# EAGLE design 74LV2G07DBVR (EAGLE 9.2.0)
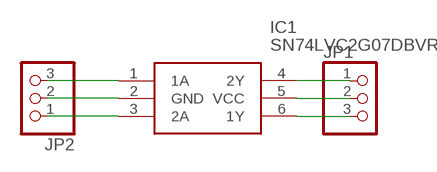
[diagram p0: schematic, sheet 1]

## Parts
IC1  SN74LVC2G07DBVR  [SOT95P280X145-6N]
JP1  PINHD-1X3  [1X03]
JP2  PINHD-1X3  [1X03]

## Nets
N$1: IC1.2(GND) JP2.2
N$2: IC1.1(1A) JP2.3
N$3: IC1.3(2A) JP2.1
N$4: IC1.6(1Y) JP1.3
N$5: IC1.4(2Y) JP1.1
N$6: IC1.5(VCC) JP1.2

## Library data of the parts
IC1 = SN74LVC2G07DBVR:SN74LVC2G07DBVR: DUAL BUFFER/DRIVER WITH OPEN-DRAIN OUTPUTS Source: Datasheet <http://componentsearchengine.com/Datasheets/3/SN74LVC2G07DBVR.pdf>; ARROW_PART_NUMBER: SN74LVC2G07DBVR; ARROW_PRICE/STOCK: https://www.arrow.com/en/products/sn74lvc2g07dbvr/texas-instruments; DESCRIPTION: DUAL BUFFER/DRIVER WITH OPEN-DRAIN OUTPUTS; HEIGHT: mm; MANUFACTURER_NAME: Texas Instruments; MANUFACTURER_PART_NUMBER: SN74LVC2G07DBVR; RS_PART_NUMBER: 6628913P; RS_PRICE/STOCK: http://uk.rs-online.com/web/p/products/6628913P
JP1 JP2 = pinhead:PINHD-1X3: PIN HEADER

## Board
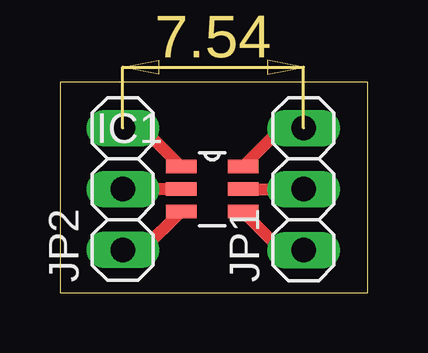
[diagram p1: board, top side]

Size 12.83 x 8.77 mm. Coordinates in mm from the lower left corner, seen from the top.
Outline: 0,0 12.83,0 12.83,8.77 0,8.77 0,0
Copper layers (1*16): Top 0.035mm / dielectric 1.5mm / Bottom 0.035mm
Design rules "default": minimum track width 6mil, minimum drill 0.35mm, track to track 6mil, track to pad 6mil, pad to pad 6mil, via to via 6mil, smd to smd 6mil, copper to edge 40mil, drill to drill 6mil, minimum pad ring 10mil, minimum via ring 8mil, stop-mask expansion 4mil, vias tented up to drill 0mil, thermal gap 10mil

### Footprints (pad centres in the part's own frame; a part is rotated, then mirrored left to right if it is on the bottom)
SOT95P280X145-6N = smd 1.27 x 0.559: 1 -1.295,0.94; 2 -1.295,0; 3 -1.295,-0.94; 4 1.295,-0.94; 5 1.295,0; 6 1.295,0.94
1X03 = drill 1.016 long: 1 -2.54,0; 2 0,0; 3 2.54,0

### Placement (x,y rotation side)
IC1  6.35,4.32 0 top
JP1  10.16,4.32 90 top
JP2  2.62,4.32 90 top

### Tracks (layer width: path | path; a pad name or v marks a point on that pad's centre or on a via)
N$1
  Top 0.508: IC1.2 JP2.2
N$2
  Top 0.508: IC1.1 3.45,6.86 JP2.3
N$3
  Top 0.508: IC1.3 3.46,1.78 JP2.1
N$4
  Top 0.508: IC1.6 9.25,6.86 JP1.3
N$5
  Top 0.508: IC1.4 9.24,1.78 JP1.1
N$6
  Top 0.508: IC1.5 JP1.2